# EAGLE schematic MX1508 H-bridge (EAGLE 9.2.2)
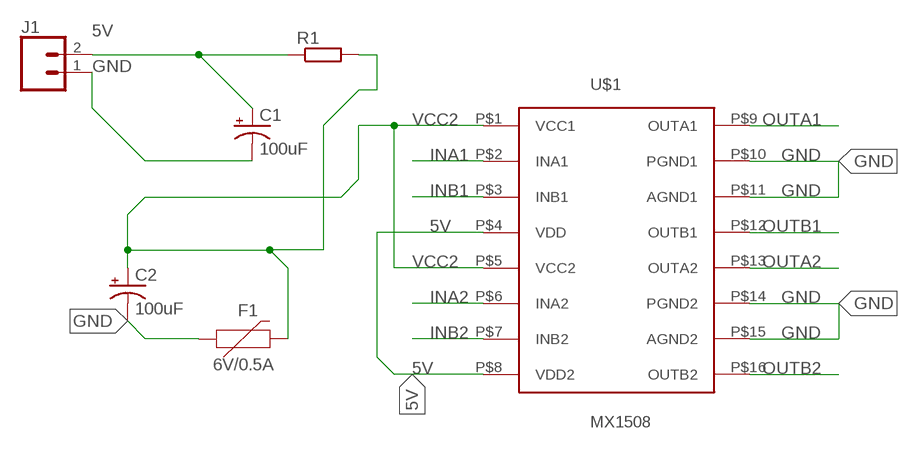
[diagram p0: schematic, sheet 1]

## Parts
C1  100uF  100UF-POLAR-10X10.5-63V-20%  [NIC_10X10.5_CAP]
C2  100uF  100UF-POLAR-10X10.5-63V-20%  [NIC_10X10.5_CAP]
F1  6V/0.5A  PPTC_HALF-AMP  [1206]
J1  CONN_02  [1X02]
R1  R-EU_M0805  [M0805]
U$1  MX1508  [MX1508]

## Nets
5V: C1.+ J1.2 R1.1 U$1.P$4(VDD) U$1.P$8(VDD2)
GND: C1.- C2.- F1.1 J1.1 U$1.P$10(PGND1) U$1.P$11(AGND1) U$1.P$14(PGND2) U$1.P$15(AGND2)
INA1: U$1.P$2(INA1)
INA2: U$1.P$6(INA2)
INB1: U$1.P$3(INB1)
INB2: U$1.P$7(INB2)
OUTA1: U$1.P$9(OUTA1)
OUTA2: U$1.P$13(OUTA2)
OUTB1: U$1.P$12(OUTB1)
OUTB2: U$1.P$16(OUTB2)
VCC2: C2.+ F1.2 R1.2 U$1.P$1(VCC1) U$1.P$5(VCC2)

## Library data of the parts
C1 C2 = SparkFun-Capacitors:100UF-POLAR: 100µF polarized capacitors A capacitor is a passive two-terminal electrical component used to store electrical energy temporarily in an electric field.; PROD_ID: CAP-08362
F1 = SparkFun-Fuses:PPTC: Resettable Fuse PPTC Resettable Fuse. Really a sort of resistor with a polymeric positive temperature coefficient whose resistance increases dramatically with an increase in temperature. When heated by the power passing through the resistance rises causing the current to be limited, protecting the circuit. This is achieved by the transition of the polymer from a crystalline to an amorphous state where the conductive carbon separates breaking the conductive pathways found in the cool crystalline structure. When a PPTC cools back down it resumes conducting letting the circuit turn back on. SparkFun Products: SparkFun RedBoard - Programmed with Arduino <https://www.sparkfun.com/products/12757> Pro Micro - 5V/16MHz <https://www.sparkfun.com/products/12640> Arduino Pro 328 - 5V/16MHz <https://www.sparkfun.com/products/10915> MP3 Trigger <https://www.sparkfun.com/products/13720>; PROD_ID: RES-08585
J1 = SparkFun-Connectors:CONN_02: Multi connection point. Often used as Generic Header-pin footprint for 0.1 inch spaced/style header connections On any of the 0.1 inch spaced packages, you can populate with these: Break Away Headers - Straight <https://www.sparkfun.com/products/116> (PRT-00116) Break Away Male Headers - Right Angle <https://www.sparkfun.com/products/553> (PRT-00553) Female Headers <https://www.sparkfun.com/products/115> (PRT-00115) Break Away Headers - Machine Pin <https://www.sparkfun.com/products/117> (PRT-00117) Break Away Female Headers - Swiss Machine Pin <https://www.sparkfun.com/products/743> (PRT-00743) For SCREWTERMINALS and SPRING TERMINALS visit here: Screw Terimnals on SparkFun.com <https://www.sparkfun.com/search/results?term=Screw+Terminals> (5mm/3.5mm/2.54mm spacing) This device is also useful as a general connection point to wire up your design to another part of your project. Our various solder wires solder well into these plated through hole pads. Hook-Up Wire - Assortment (Stranded, 22 AWG) <https://www.sparkfun.com/products/11375> (PRT-11375) Hook-Up Wire - Assortment (Solid Core, 22 AWG) <https://www.sparkfun.com/products/11367> (PRT-11367) View the entire wire category on our website here <https://www.sparkfun.com/categories/141> Special notes: Molex polarized connector foot print use with: PRT-08233 with associated crimp pins and housings. 2.54_SCREWTERM for use with PRT-10571. 3.5mm Screw Terminal footprints for PRT-08084 5mm Screw Terminal footprints for use with PRT-08432
R1 = rcl:R-EU_: RESISTOR, European symbol; SPICEPREFIX: R
U$1 = mx1508:MX1508: MX1508 Dual H-bridge Motor Driver Created by: Dhanush Tummala